# EAGLE schematic untitled (EAGLE 6.1)
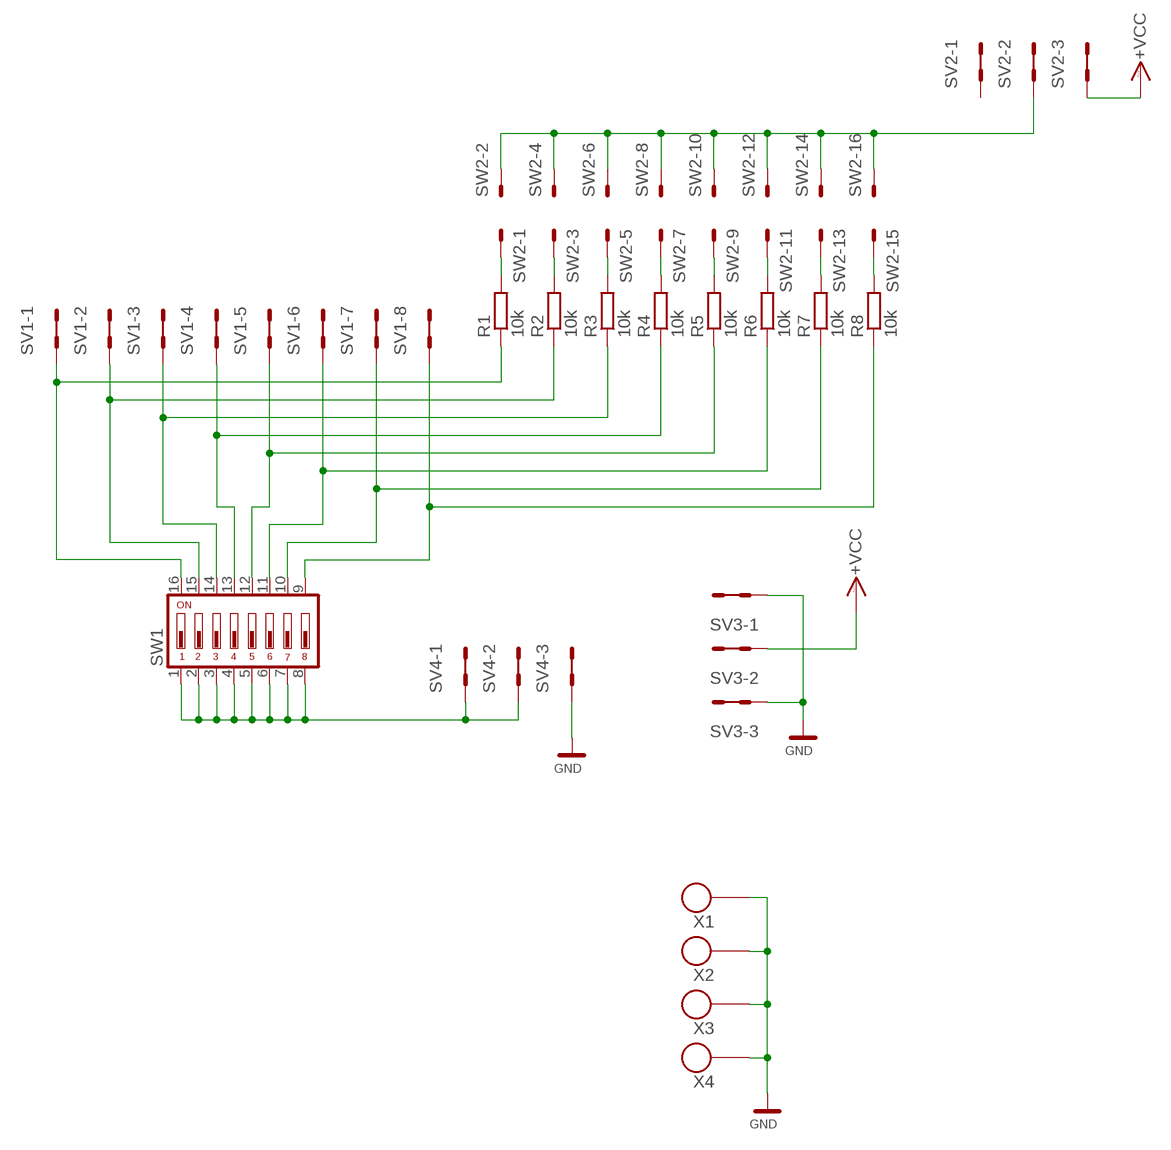
[diagram p0: schematic, sheet 1]

## Parts
R1  10k  R0805  [0805]
R2  10k  R0805  [0805]
R3  10k  R0805  [0805]
R4  10k  R0805  [0805]
R5  10k  R0805  [0805]
R6  10k  R0805  [0805]
R7  10k  R0805  [0805]
R8  10k  R0805  [0805]
SV1  MA08-2  [MA08-2]
SV2  MA03-2  [MA03-2]
SV3  MA03-2  [MA03-2]
SV4  MA03-2  [MA03-2]
SW1  DIP-08  [DIP08SW]
SW2  MA08-3  [MA08-2]
X1  SROUB3M  [SROUB3M]
X2  SROUB3M  [SROUB3M]
X3  SROUB3M  [SROUB3M]
X4  SROUB3M  [SROUB3M]

## Nets
GND: SV3.1 SV3.2 SV3.5 SV3.6 SV4.5 SV4.6 X1.P$1 X2.P$1 X3.P$1 X4.P$1
N$1: R1.1 SV1.1 SV1.2 SW1.16
N$2: R2.1 SV1.3 SV1.4 SW1.15
N$3: R3.1 SV1.5 SV1.6 SW1.14
N$4: R4.1 SV1.7 SV1.8 SW1.13
N$5: R5.1 SV1.9 SV1.10 SW1.12
N$6: R6.1 SV1.11 SV1.12 SW1.11
N$7: R7.1 SV1.13 SV1.14 SW1.10
N$8: R8.1 SV1.15 SV1.16 SW1.9
N$9: R1.2 SW2.1
N$10: R2.2 SW2.3
N$11: R3.2 SW2.5
N$12: R4.2 SW2.7
N$13: R5.2 SW2.9
N$14: R6.2 SW2.11
N$15: R7.2 SW2.13
N$16: R8.2 SW2.15
N$20: SV2.3 SV2.4 SW2.2 SW2.4 SW2.6 SW2.8 SW2.10 SW2.12 SW2.14 SW2.16
N$22: SV4.1 SV4.2 SV4.3 SV4.4 SW1.1 SW1.2 SW1.3 SW1.4 SW1.5 SW1.6 SW1.7 SW1.8
VCC: SV2.5 SV2.6 SV3.3 SV3.4 ; supply symbol labelled +VCC
Unconnected: SV2.1 SV2.2

## Library data of the parts
R1-R8 = moje_R:R0805
SV1 = moje_hrebinky:MA08-2: PIN HEADER; OC_FARNELL: unknown; OC_NEWARK: unknown
SV2-SV4 = moje_hrebinky:MA03-2: PIN HEADER; OC_FARNELL: unknown; OC_NEWARK: unknown
SW1 = moje_tlacitka:DIP-08
SW2 = moje_hrebinky:MA08-3
X1-X4 = moje:SROUB3M